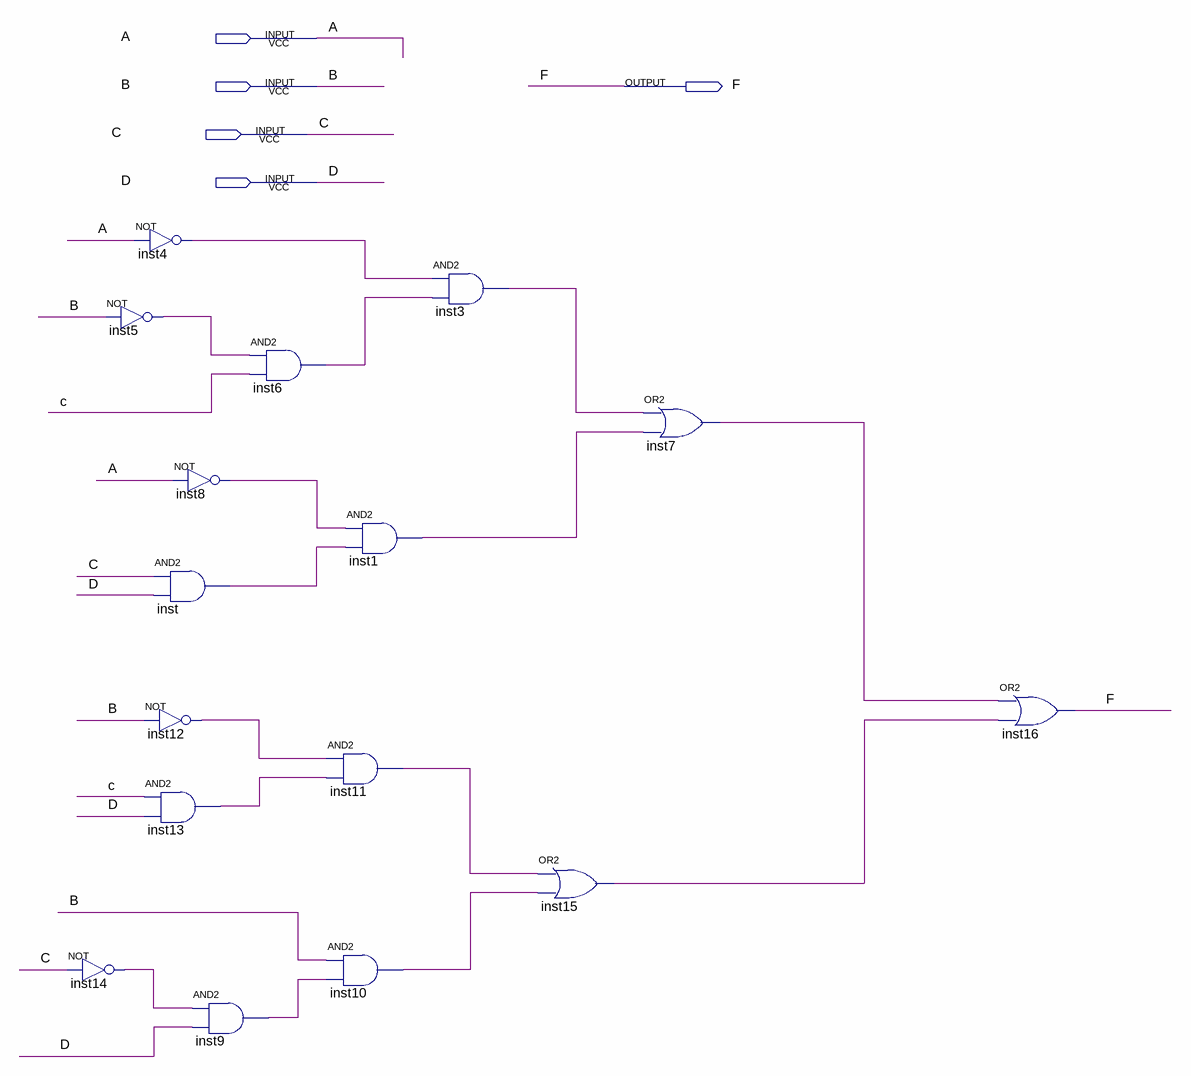
[diagram p0: schematic sheet]
// Quartus schematic prime.bdf as structural Verilog: 16 symbols, 5 pins
module prime (
  input  A,
  input  B,
  input  C,
  input  D,
  output F
);

  wire inst1_out, inst3_out, inst4_out, inst5_out, inst6_out, inst7_out, inst8_out, inst9_out, inst10_out,
       inst11_out, inst12_out, inst13_out, inst14_out, inst15_out, inst_out;

  not inst5 (inst5_out, B);
  not inst14 (inst14_out, C);
  not inst4 (inst4_out, A);
  not inst8 (inst8_out, A);
  and inst (inst_out, C, D);
  not inst12 (inst12_out, B);
  and inst13 (inst13_out, C, D);
  and inst9 (inst9_out, inst14_out, D);
  and inst6 (inst6_out, inst5_out, C);
  and inst1 (inst1_out, inst8_out, inst_out);
  and inst11 (inst11_out, inst12_out, inst13_out);
  and inst10 (inst10_out, B, inst9_out);
  and inst3 (inst3_out, inst4_out, inst6_out);
  or inst15 (inst15_out, inst11_out, inst10_out);
  or inst7 (inst7_out, inst3_out, inst1_out);
  or inst16 (F, inst7_out, inst15_out);
endmodule
